# EAGLE design CH552_typeC_Power_Delivery (EAGLE 9.6.2)
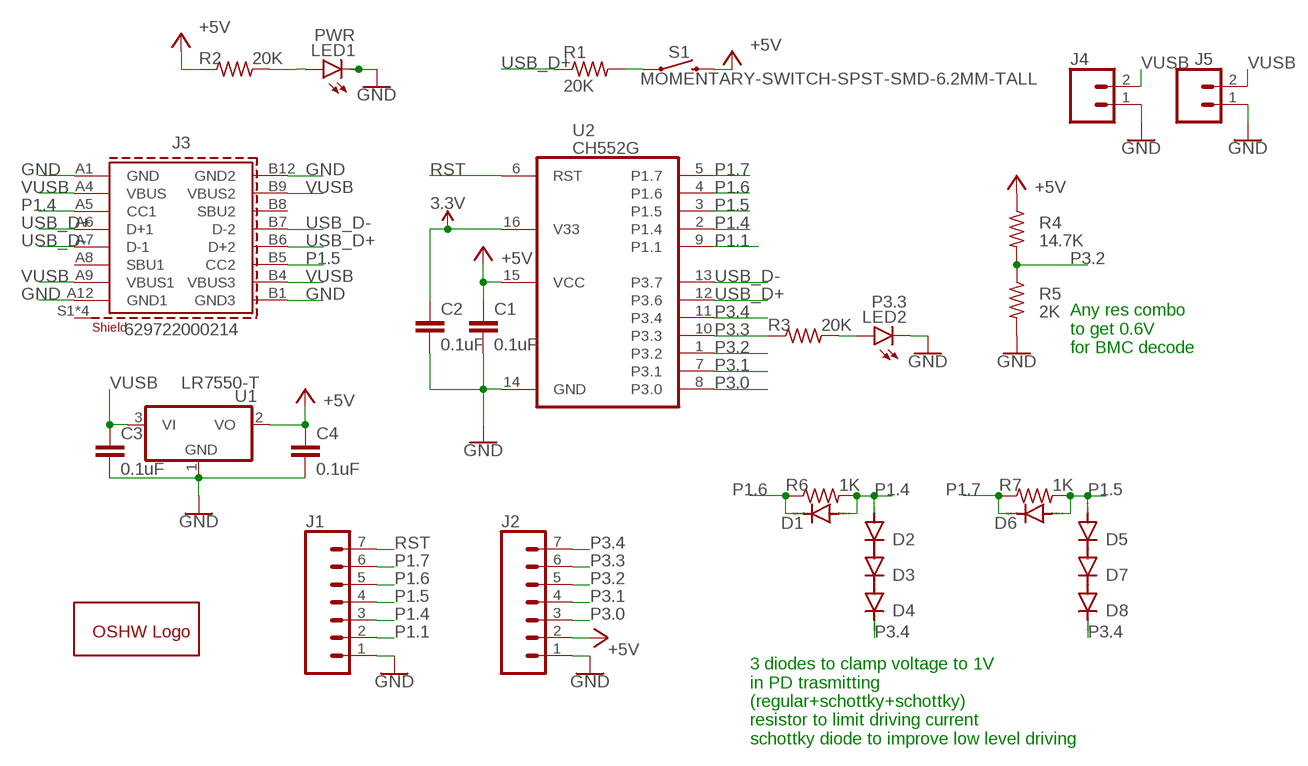
[diagram p0: schematic, sheet 1]

## Parts
C1  0.1uF  C-EUC0805K  [C0805K]
C2  0.1uF  C-EUC0805K  [C0805K]
C3  0.1uF  C-EUC0805K  [C0805K]
C4  0.1uF  C-EUC0805K  [C0805K]
D1  DIODE-SOD123  [SOD123]
D2  DIODE-SOD123  [SOD123]
D3  DIODE-SOD123  [SOD123]
D4  DIODE-SOD123  [SOD123]
D5  DIODE-SOD123  [SOD123]
D6  DIODE-SOD123  [SOD123]
D7  DIODE-SOD123  [SOD123]
D8  DIODE-SOD123  [SOD123]
GOLD_ORB_SM1  OSHWLOGOLOGO8MM  [OSHW_8MM]
J1  CONN_07NO_SILK  [1X07_NO_SILK]
J2  CONN_07NO_SILK  [1X07_NO_SILK]
J3  629722000214  [629722000214]
J4  CONN_021X02_NO_SILK  [1X02_NO_SILK]
J5  CONN_021X02_NO_SILK  [1X02_NO_SILK]
LED1  PWR  GHI-BASICCOMPONENTS_LED-(INCH)-0805  [GHI-BASICCOMPONENTS_0805-LED]
LED2  P3.3  GHI-BASICCOMPONENTS_LED-(INCH)-0805  [GHI-BASICCOMPONENTS_0805-LED]
R1  20K  R-US_R0805  [R0805]
R2  20K  R-US_R0805  [R0805]
R3  20K  R-US_R0805  [R0805]
R4  14.7K  R-US_R0805  [R0805]
R5  2K  R-US_R0805  [R0805]
R6  1K  R-US_R0805  [R0805]
R7  1K  R-US_R0805  [R0805]
S1  MOMENTARY-SWITCH-SPST-SMD-6.2MM-TALL  [TACTILE_SWITCH_SMD_6.2MM_TALL]
U1  MCP1703CB  [SOT23]
U2  CH552G  MY_IC_CH551G_CH552GSOP-16  [MY_IC_SO16]

## Nets
3.3V: C2.1 U2.16(V33)
+5V: C1.1 C4.1 J2.2 R2.1 R4.1 S1.B2 U1.2(VO) U2.15(VCC)
GND: C1.2 C2.2 C3.2 C4.2 J1.1 J2.1 J3.A1(GND) J3.A12(GND1) J3.B1(GND3) J3.B12(GND2) J4.1 J5.1 LED1.K LED2.K R5.2 U1.1(GND) U2.14(GND)
N$1: R1.2 S1.A2
N$2: LED2.A R3.2
N$3: LED1.A R2.2
N$4: D2.C D3.A
N$5: D3.C D4.A
N$6: D5.C D7.A
N$7: D7.C D8.A
P1.1: J1.2 U2.9(P1.1)
P1.4: D1.A D2.A J1.3 J3.A5(CC1) R6.2 U2.2(P1.4)
P1.5: D5.A D6.A J1.4 J3.B5(CC2) R7.2 U2.3(P1.5)
P1.6: D1.C J1.5 R6.1 U2.4(P1.6)
P1.7: D6.C J1.6 R7.1 U2.5(P1.7)
P3.0: J2.3 U2.8(P3.0)
P3.1: J2.4 U2.7(P3.1)
P3.2: J2.5 R4.2 R5.1 U2.1(P3.2)
P3.3: J2.6 R3.1 U2.10(P3.3)
P3.4: D4.C D8.C J2.7 U2.11(P3.4)
RST: J1.7 U2.6(RST)
USB_D+: J3.A6(D+1) J3.B6(D+2) R1.1 U2.12(P3.6)
USB_D-: J3.A7(D-1) J3.B7(D-2) U2.13(P3.7)
VUSB: C3.1 J3.A4(VBUS) J3.A9(VBUS1) J3.B4(VBUS3) J3.B9(VBUS2) J4.2 J5.2 U1.3(VI)
Unconnected: J3.A8(SBU1) J3.B8(SBU2) J3.S1(SHIELD) J3.S2(SHIELD) J3.S3(SHIELD) J3.S4(SHIELD)

## Notes on the sheet
- Any res combo
  to get 0.6V
  for BMC decode
- 3 diodes to clamp voltage to 1V
  in PD trasmitting
  (regular+schottky+schottky)
  resistor to limit driving current
  schottky diode to improve low level driving

## Library data of the parts
C1-C4 = rcl:C-EU: CAPACITOR, European symbol; LCSC: C16834; SPICEPREFIX: C
D1-D8 = diode:DIODE-: DIODE
GOLD_ORB_SM1 = oshw:OSHWLOGO: The OSHW logo for PCB layout
J1 J2 = SparkFun-Connectors:CONN_07: Multi connection point. Often used as Generic Header-pin footprint for 0.1 inch spaced/style header connections On any of the 0.1 inch spaced packages, you can populate with these: Break Away Headers - Straight <https://www.sparkfun.com/products/116> (PRT-00116) Break Away Male Headers - Right Angle <https://www.sparkfun.com/products/553> (PRT-00553) Female Headers <https://www.sparkfun.com/products/115> (PRT-00115) Break Away Headers - Machine Pin <https://www.sparkfun.com/products/117> (PRT-00117) Break Away Female Headers - Swiss Machine Pin <https://www.sparkfun.com/products/743> (PRT-00743) For SCREWTERMINALS and SPRING TERMINALS visit here: Screw Terimnals on SparkFun.com <https://www.sparkfun.com/search/results?term=Screw+Terminals> (5mm/3.5mm/2.54mm spacing) This device is also useful as a general connection point to wire up your design to another part of your project. Our various solder wires solder well into these plated through hole pads. Hook-Up Wire - Assortment (Stranded, 22 AWG) <https://www.sparkfun.com/products/11375> (PRT-11375) Hook-Up Wire - Assortment (Solid Core, 22 AWG) <https://www.sparkfun.com/products/11367> (PRT-11367) View the entire wire category on our website here <https://www.sparkfun.com/categories/141> Special notes: Molex polarized connector foot print use with SKU : PRT-08231 with associated crimp pins and housings. 1MM SMD Version SKU: PRT-10208 NOTES ON THE VARIANTS LOCK and LOCK_LONGPADS... This footprint was designed to help hold the alignment of a through-hole component (i.e. 6-pin header) while soldering it into place. You may notice that each hole has been shifted either up or down by 0.005 of an inch from it's more standard position (which is a perfectly straight line). This slight alteration caused the pins (the squares in the middle) to touch the edges of the holes. Because they are alternating, it causes a "brace" to hold the component in place. 0.005 has proven to be the perfect amount of "off-center" position when using our standard breakaway headers. Although looks a little odd when you look at the bare footprint, once you have a header in there, the alteration is very hard to notice. Also,if you push a header all the way into place, it is covered up entirely on the bottom side.
J3 = Wurth_Connectors_WR-USB:629722000214: WR-COM USB 2.0 Type C Receptacle Horizontal SMT Kind Properties Durability 10 000 Mating cycles Gender Receptacle Type Horizontal General Information Operating Temperature -40 up to +85 °C Electrical Properties Working Voltage 20 V (DC) Withstanding Voltage 100 V (AC) Contact Resistance 40 mΩ Material Properties Insulator Material LCP Insulator Flammability Rating UL94 V-0 Insulator Color Black Contact Material Brass Contact Plating Gold over Nickel Contact Type Stamped Shielding Material Steel Shielding Plating Nickel (Ni) <https://www.we-online.com/components/media/o689297v209%20family-wr-com-629722000214.jpg> Details see: www.we-online.com/en/components/products/WR-COM_USB_20_TYPE_C_RECEPTACLE_HORIZONTAL_SMT <www.we-online.com/catalog/WR-COM_USB_20_TYPE_C_RECEPTACLE_HORIZONTAL_SMT/?utm_source=eagle_model&utm_medium=description_link&utm_campaign=eisos_eagle> Updated by Ella Wu 2023-05-30 2023 (C) Würth Elektronik; APPLICATION: USB 2.0; DATASHEET-URL: https://www.we-online.com/redexpert/spec/629722000214?ae; GERDER: Receptacle; INTERFACE-TYPE: Type C; IR: 5A; LCSC: C165948 C2765186; MOUNT: SMT; PACKAGING: Tape and Reel; PART-NUMBER: 629722000214; PINS: 16; TYPE: Horizontal; WORKING-VOLTAGE: 20V(AC)
J4 J5 = SparkFun-Connectors:CONN_02: Multi connection point. Often used as Generic Header-pin footprint for 0.1 inch spaced/style header connections On any of the 0.1 inch spaced packages, you can populate with these: Break Away Headers - Straight <https://www.sparkfun.com/products/116> (PRT-00116) Break Away Male Headers - Right Angle <https://www.sparkfun.com/products/553> (PRT-00553) Female Headers <https://www.sparkfun.com/products/115> (PRT-00115) Break Away Headers - Machine Pin <https://www.sparkfun.com/products/117> (PRT-00117) Break Away Female Headers - Swiss Machine Pin <https://www.sparkfun.com/products/743> (PRT-00743) For SCREWTERMINALS and SPRING TERMINALS visit here: Screw Terimnals on SparkFun.com <https://www.sparkfun.com/search/results?term=Screw+Terminals> (5mm/3.5mm/2.54mm spacing) This device is also useful as a general connection point to wire up your design to another part of your project. Our various solder wires solder well into these plated through hole pads. Hook-Up Wire - Assortment (Stranded, 22 AWG) <https://www.sparkfun.com/products/11375> (PRT-11375) Hook-Up Wire - Assortment (Solid Core, 22 AWG) <https://www.sparkfun.com/products/11367> (PRT-11367) View the entire wire category on our website here <https://www.sparkfun.com/categories/141> Special notes: Molex polarized connector foot print use with: PRT-08233 with associated crimp pins and housings. 2.54_SCREWTERM for use with PRT-10571. 3.5mm Screw Terminal footprints for PRT-08084 5mm Screw Terminal footprints for use with PRT-08432
LED1 LED2 = BeagleBone_Black_Wireless:GHI-BASICCOMPONENTS_LED-(INCH)-
R1-R7 = rcl:R-US_: RESISTOR, American symbol; SPICEPREFIX: R
S1 = SparkFun-Switches:MOMENTARY-SWITCH-SPST: Momentary Switch (Pushbutton) - SPST Normally-open (NO) SPST momentary switches (buttons, pushbuttons). Variants PTH-12MM - 12mm square, through-hole Momentary Pushbutton Switch - 12mm Square <https://www.sparkfun.com/products/9190> (COM-09190) PTH-6.0MM, PTH-6.0MM-KIT - 6.0mm square, through-hole Mini Pushbutton Switch <https://www.sparkfun.com/products/97> (COM-00097) KIT package intended for soldering kit's - only one side of pads' copper is exposed. PTH-RIGHT-ANGLE-KIT - Right-angle, through-hole Right Angle Tactile Button <https://www.sparkfun.com/products/10791> - Used on SparkFun BigTime Watch Kit <https://www.sparkfun.com/products/11734> SMD-12MM - 12mm square, surface-mount Tactile Button - SMD (12mm) <https://www.sparkfun.com/products/12993> (COM-12993) Used on SparkFun PicoBoard <https://www.sparkfun.com/products/11888> SMD-4.5MM - 4.5mm Square Trackball Switch Used on SparkFun Blackberry Trackballer Breakout <https://www.sparkfun.com/products/13169> SMD-4.6MMX2.8MM - 4.60mm x 2.80mm, surface mount Used on SparkFun SAMD21 Mini Breakout <https://www.sparkfun.com/products/13664> SMD-5.2MM, SMD-5.2-REDUNDANT - 5.2mm square, surface-mount Mini Pushbutton Switch - SMD <https://www.sparkfun.com/products/8720> (COM-08720) Used on Arduino Pro Mini <https://www.sparkfun.com/products/11114> REDUNDANT package connects both switch circuits together SMD-6.0X3.5MM - 6.0 x 3.5mm, surface mount Momentary Reset Switch SMD <https://www.sparkfun.com/products/8229> (COM-08229) SMD-6.2MM-TALL - 6.2mm square, surface mount Tactile Button - SMD (6mm) <https://www.sparkfun.com/products/12992> Used on SparkFun Digital Sandbox <https://www.sparkfun.com/products/12651> SMD-RIGHT-ANGLE - Right-angle, surface mount Used on SparkFun Block for Intel® Edison - Arduino <https://www.sparkfun.com/products/13036>; PROD_ID: SWCH-11966; SF_SKU: COM-12992
U1 = linear:MCP1703: 250 mA, 16V, Low Quiescent Current LDO Regulator Source: http://ww1.microchip.com/downloads/en/DeviceDoc/22049b.pdf; ACTUAL_PART: LR7550-T
U2 = myOwnLib:MY_IC_CH551G_CH552G; LCSC: C111292

## Board
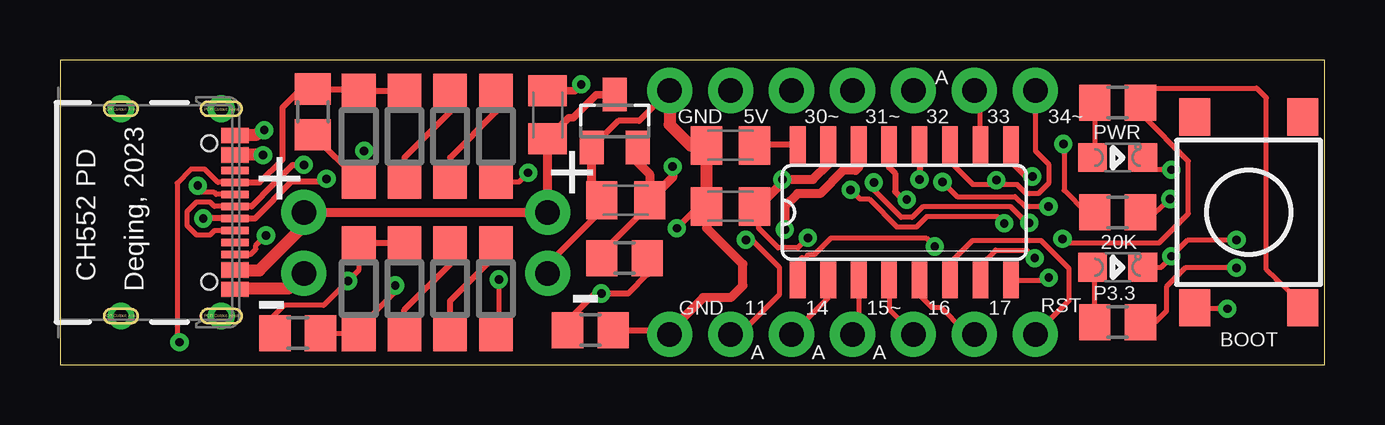
[diagram p1: board, top side]
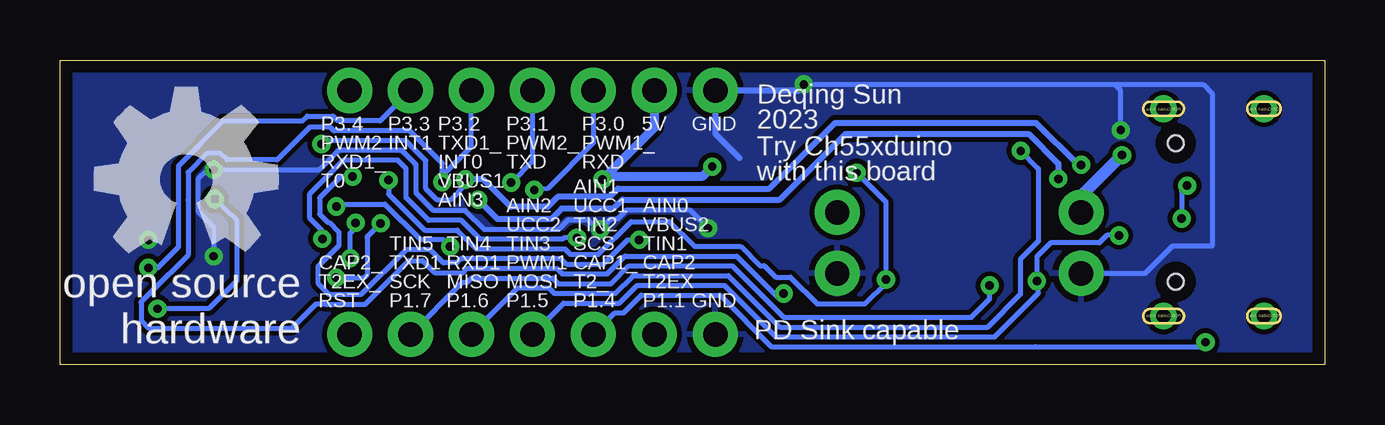
[diagram p2: board, bottom side, seen from below]

Size 52.7 x 12.7 mm. Coordinates in mm from the lower left corner, seen from the top.
Outline: 0,0 52.7,0 52.7,12.7 0,12.7 0,0
Copper layers (1*16): Top 0.035mm / dielectric 1.5mm / Bottom 0.035mm
Design rules "eagleRules10Mil *": minimum track width 8mil, minimum drill 0.3mm, track to track 8mil, track to pad 8mil, pad to pad 8mil, via to via 8mil, smd to smd 8mil, copper to edge 20mil, drill to drill 20mil, minimum pad ring 10mil, minimum via ring 8mil, stop-mask expansion 4mil, vias tented up to drill 14mil, thermal gap 10mil

### Footprints (pad centres in the part's own frame; a part is rotated, then mirrored left to right if it is on the bottom)
C0805K = smd 1.3 x 1.6: 1 -1,0; 2 1,0
SOD123 = smd 1.4 x 1.4: A 1.9,0; C -1.9,0
1X07_NO_SILK = drill 1.016 pad 1.88: 1 0,0; 2 2.54,0; 3 5.08,0; 4 7.62,0; 5 10.16,0; 6 12.7,0; 7 15.24,0
629722000214 = smd 0.3 x 1.15: A1 -3.35,4.745; A4 -2.55,4.745; A5 -1.25,4.745; A6 -0.25,4.745; A7 0.25,4.745; A8 1.25,4.745; A9 2.55,4.745; A12 3.35,4.745; B1 3.05,4.745; B4 2.25,4.745; B5 1.75,4.745; B6 0.75,4.745; B7 -0.75,4.745; B8 -1.75,4.745; B9 -2.25,4.745; B12 -3.05,4.745 | drill 0.6 pad 1: S1 -4.32,4.18; S2 4.32,4.18; S3 -4.32,0; S4 4.32,0 | hole 0.65: -2.89,3.68; 2.89,3.68
1X02_NO_SILK = drill 1.016 pad 1.88: 1 0,0; 2 2.54,0
GHI-BASICCOMPONENTS_0805-LED = smd 1.2 x 1.2: A 0,1.05; K 0,-1.05
R0805 = smd 1.3 x 1.5: 1 -0.95,0; 2 0.95,0
TACTILE_SWITCH_SMD_6.2MM_TALL = smd 1.55 x 1.3: A1 -3.975,-2.25; A2 3.975,-2.25; B1 -3.975,2.25; B2 3.975,2.25
SOT23 = smd 1 x 1.4: 1 -0.95,-1.1; 2 0.95,-1.1; 3 0,1.1
MY_IC_SO16 = smd 0.66 x 1.524: 1 -4.445,-2.819; 2 -3.175,-2.819; 3 -1.905,-2.819; 4 -0.635,-2.819; 5 0.635,-2.819; 6 1.905,-2.819; 7 3.175,-2.819; 8 4.445,-2.819; 9 4.445,2.819; 10 3.175,2.819; 11 1.905,2.819; 12 0.635,2.819; 13 -0.635,2.819; 14 -1.905,2.819; 15 -3.175,2.819; 16 -4.445,2.819

### Placement (x,y rotation side)
C1  27.94,6.6 180 top
C2  27.94,9.14 180 top
C3  20.32,10.41 90 top
C4  23.57,6.86 180 top
D1  12.45,9.53 90 top
D2  14.35,9.53 90 top
D3  16.26,9.53 90 top
D4  18.16,9.53 90 top
D5  14.35,3.17 90 top
D6  12.45,3.17 90 top
D7  16.26,3.17 90 top
D8  18.16,3.17 90 top
GOLD_ORB_SM1  47.47,7.72 0 bottom
J1  25.4,1.27 0 top
J2  25.4,11.43 0 top
J3  2.54,6.35 270 top
J4  10.16,3.81 90 top
J5  20.32,3.81 90 top
LED1  44.07,8.64 90 top
LED2  44.07,4.06 90 top
R1  44.07,6.35 0 top
R2  44.07,10.92 180 top
R3  44.07,1.78 180 top
R4  23.52,4.45 0 top
R5  22.1,1.45 0 top
R6  10.54,10.54 90 top
R7  9.91,1.32 180 top
S1  49.53,6.35 270 top
U1  23.11,10.16 0 top
U2  35.18,6.35 0 top

### Tracks (layer width: path | path; a pad name or v marks a point on that pad's centre or on a via)
3.3V
  Top 0.254: U2.16 28.96,9.17 C2.1
+5V  (via drill 0.35)
  Top 0.203: v31.16,5.29 30.75,4.88 29.92,4.88 29.11,5.69 29.11,6.45 | v41.77,5.25 41.94,5.08 45.8,5.08 47.02,6.3 47.02,8.48 45.11,10.39 45.11,10.83 R2.1 45.63,11.53 49.86,11.53 50.27,11.12 50.27,3.96 50.67,3.56 51.78,2.49 S1.B2
  Top 0.254: C1.1 29.11,6.6 | 30.1,7.59 v30.1,7.72 | C4.1 24.57,6.66 22.57,4.66 R4.1
  Top 0.305: 29.11,6.6 28.96,6.6 C1.1
  Top 0.381: v30.1,7.72 31.37,7.72 32,8.36 U2.15 | 29.11,6.6 30.1,7.59 | v25.53,8.26 25.53,7.81 C4.1 24.57,7.94 24.06,8.45 U1.2
  Top 0.508: 29.11,6.45 28.96,6.6
  Bottom 0.203: v31.16,5.29 31.7,5.29 31.76,5.23 35.2,5.23 35.98,6.02 37.34,6.02 38.28,6.96 38.28,8.18 38.63,8.53 40.9,8.53 42.29,7.13 42.29,6.1 41.77,5.58 v41.77,5.25
  Bottom 0.381: J2.2 27.94,9.88 v30.1,7.72 29.96,7.86 25.92,7.86 v25.53,8.26
GND  (via drill 0.35)
  Top 0.203: v46.3,8.13 45.63,8.13 LED1.K | LED2.K 45.88,4.06 46.3,4.49 v46.3,4.52 46.99,5.21 v49.02,5.21 | J3.A12 J3.B1 7.41,3.17
  Top 0.254: C1.2 26.62,6.6 v25.7,5.69 | J2.1 24.13,10.16 23.26,10.16 U1.1 | C4.2 22.57,6.44 20.32,4.19 J5.1 | R5.2 25.22,1.45 J1.1 | J3.A1 7.41,9.57 7.29,9.45 J3.B12 | 8.38,9.78 v8.51,9.78
  Top 0.305: C3.2 21.45,11.41 v21.72,11.68
  Top 0.381: v30.2,5.64 30.2,6.6 30.73,7.14 31.67,7.14 32.64,8.1 33.15,8.1 33.27,8.23 U2.14 | C1.2 26.94,5.7 28.45,4.19 28.45,3.3 27.94,2.79 26.8,2.79 25.4,1.4 J1.1 | C4.2 22.16,7.26 U1.1
  Top 0.508: C1.2 C2.2 26.26,9.14 25.4,10.01 J2.1 | 7.41,9.57 8.18,9.57 8.38,9.78 | J4.1 9.53,3.17 7.41,3.17 7.4,3.19 7.31,3.19
  Bottom 0.203: v46.3,4.52 46.3,5.74 46.97,6.4 46.97,7.72 46.56,8.13 v46.3,8.13 41.91,8.13 41.1,8.93 38.46,8.93 37.87,8.34 37.87,7.17 37.12,6.43 35.81,6.43 35.03,5.64 31.93,5.64 31.52,6.04 30.71,6.04 30.3,5.64 v30.2,5.64 29.76,6.08 29.47,6.08 29.1,6.45 26.47,6.45 v25.7,5.69 | v21.72,11.68 8.76,11.68 | 8.76,11.68 5.08,11.68 4.7,11.3 4.7,4.95 6.35,4.95 7.49,3.81 J4.1 | v8.51,9.78 8.51,11.43 8.76,11.68
  Bottom 0.254: 24.38,8.61 25.4,9.63 J2.1 21.97,11.43
  Bottom 0.305: 21.97,11.43 v21.72,11.68
  pour Bottom: 0,0 52.7,0 52.7,12.7 0,12.7
N$1  (via drill 0.35)
  Top 0.203: R1.2 45.64,6.35 v46.25,6.91 | v48.64,2.34 47.32,2.34 S1.A2
  Bottom 0.203: v46.25,6.91 45.34,6.04 45.34,3.5 46.51,2.34 v48.64,2.34
N$2
  Top 0.203: R3.2 43.12,3.96 LED2.A
N$3
  Top 0.203: R2.2 43.12,8.74 LED1.A
N$4
  Top 0.254: D3.A 16.26,10.54 14.35,8.64 D2.C
N$5
  Top 0.254: D4.A 18.16,10.54 16.26,8.64 D3.C
N$6
  Top 0.254: D5.C 14.35,2.29 16.26,4.19 D7.A
N$7
  Top 0.254: D7.C 16.26,2.67 18.16,4.57 D8.A
P1.1  (via drill 0.35)
  Top 0.203: v40.51,7.84 40.24,7.84 39.6,8.48 39.6,9.14 U2.9 | v28.57,5.21 28.83,5.21 29.97,4.06 29.97,2.92 28.32,1.27 J1.2
  Bottom 0.203: v40.51,7.84 41,7.84 41.88,6.96 41.88,6.27 41.54,5.93 41.49,5.93 41.09,5.53 41.09,4.96 41.96,4.09 41.96,3.4 41.48,2.92 40.16,2.92 38.29,4.8 37.28,4.8 36.73,4.25 36.17,4.25 35.99,4.42 31.83,4.42 31.61,4.2 30.07,4.2 29.06,5.21 v28.57,5.21
P1.4  (via drill 0.35)
  Top 0.203: U2.2 32,2.79 J1.3 | J3.A5 6.57,7.6 6.02,8.15 5.46,8.15 4.88,7.57 4.88,1.04 v4.98,0.94
  Top 0.254: D2.A D1.A 12.38,11.49 R6.2 10.03,11.49 9.27,10.73 9.27,8.55 8.32,7.6 J3.A5
  Bottom 0.203: J1.3 29.58,2.17 29.22,2.17 28.49,2.9 25.2,2.9 23.06,0.76 12.06,0.76 4.98,0.76 v4.98,0.94
P1.5  (via drill 0.35)
  Top 0.203: U2.3 33.27,1.52 J1.4 | D6.A 12.45,3.94 v12,3.49 10.99,2.48 9.34,2.48 8.76,1.91 | J3.B5 7.94,4.6 8.16,4.82 8.16,4.97 v8.58,5.39
  Top 0.254: D5.A D6.A | R7.2 8.76,1.51 8.76,1.91
  Bottom 0.203: J1.4 31.72,2.57 29.39,2.57 28.66,3.31 25.02,3.31 22.89,1.17 13.76,1.17 11.94,2.99 11.94,3.49 v12,3.49 12,4.51 11.43,5.08 9.4,5.08 9.09,5.39 v8.58,5.39
P1.6  (via drill 0.35)
  Top 0.203: U2.4 34.54,2.29 J1.5 | D1.C 12.68,7.85 v12.68,8.91
  Top 0.254: R6.1 12.45,7.69 D1.C
  Bottom 0.203: J1.5 33.63,3.2 32.34,3.2 32.12,2.98 29.56,2.98 28.83,3.71 24.85,3.71 22.72,1.57 14.05,1.57 12.68,2.94 12.68,4.4 11.94,5.15 11.94,8.18 v12.68,8.91
P1.7  (via drill 0.35)
  Top 0.203: U2.5 35.81,2.9 36.32,2.39 36.7,2.39 37.64,1.45 37.92,1.45 J1.6 | R7.1 12.4,1.32 D6.C 12.45,1.52 13.97,3.05 v13.97,3.3
  Bottom 0.203: J1.6 35.94,3.44 35.74,3.44 35.57,3.61 32.17,3.61 31.95,3.39 29.73,3.39 29,4.12 24.68,4.12 22.55,1.98 14.73,1.98 13.97,2.74 v13.97,3.3
P3.0  (via drill 0.35)
  Top 0.203: v32.94,7.29 33.33,6.91 33.72,6.91 34.88,5.74 35.68,5.74 36.11,6.17 39.06,6.17 v39.34,5.89 | U2.8 41.1,3.53 v41.2,3.63
  Bottom 0.203: J2.3 30.48,9.25 32.38,7.34 v32.94,7.29 | v41.2,3.63 40.03,3.63 39.9,3.76 39.9,5.33 v39.34,5.89
P3.1  (via drill 0.35)
  Top 0.203: v33.91,7.59 33.91,7.29 35.05,6.15 35.51,6.15 35.94,6.58 39.62,6.58 40.29,5.92 v40.39,5.92 | U2.7 38.35,4.14 38.99,4.78 40.28,4.78 v40.62,4.45
  Bottom 0.203: J2.4 33.02,8.48 v33.91,7.59 | v40.62,4.45 40.62,5.49 40.39,5.71 v40.39,5.92
P3.2  (via drill 0.35)
  Top 0.203: U2.1 30.73,4.29 30.91,4.47 31.07,4.47 31.2,4.61 31.44,4.61 32.13,5.29 36.09,5.29 v36.45,4.93 | v36.77,7.62 37.38,7.01 39.8,7.01 40.21,6.6 40.86,6.6 40.87,6.59 v41.19,6.59
  Top 0.254: R4.2 24.47,3.77 23.67,2.97 v22.55,2.97 22.27,2.97 21.15,1.84 R5.1
  Bottom 0.203: J2.5 35.56,9.09 36.77,7.88 v36.77,7.62 36.77,8.39 38.13,9.75 41.29,9.75 41.45,9.91 42.29,9.91 43.66,8.53 45.74,8.53 46.02,8.81 46.59,8.81 47.37,8.03 47.37,6.86 47.37,4.57 48.92,3.02 49.32,2.62 49.32,1.83 49.02,1.52 43.05,1.52 42.04,2.54 41.67,2.54 41.65,2.52 40,2.52 38.17,4.34 37.59,4.34 37.09,3.84 35.91,3.84 35.74,4.01 32,4.01 31.78,3.79 29.9,3.79 29.17,4.52 24.52,4.52 22.79,2.79 22.55,2.79 v22.55,2.97 | v36.45,4.93 36.73,5.21 37.68,5.21 39.17,6.7 41.19,6.7 v41.19,6.59
P3.3  (via drill 0.35)
  Top 0.203: U2.10 38.35,11.18 J2.6 | v49.02,4.04 46.89,4.04 46.1,3.25 46.1,2.23 45.64,1.78 R3.1
  Bottom 0.203: J2.6 39.37,10.16 40.89,10.16 40.92,10.19 41.16,10.19 41.33,10.36 42.41,10.36 42.61,10.16 45.9,10.16 47.78,8.28 47.78,4.9 48.64,4.04 v49.02,4.04
P3.4  (via drill 0.35)
  Top 0.203: U2.11 37.08,8.46 38.02,7.52 38.73,7.52 | 38.73,7.52 39.87,7.52 40.25,7.13 40.77,7.13 41.2,7.56 41.2,8.36 40.64,8.91 J2.7 | 38.73,7.52 38.91,7.69 v39.01,7.69 | v18.29,3.56 18.29,1.4 D8.C | D4.C 19.13,7.62 v19.51,8
  Bottom 0.203: v39.01,7.69 39.01,7.12 37.51,5.61 36.15,5.61 35.36,4.83 31.66,4.83 31.44,4.61 30.27,4.61 28.9,5.97 27.3,5.97 26.27,4.93 24.35,4.93 23.55,4.13 23.37,4.13 22.89,3.65 22.27,3.65 21.16,2.54 19.18,2.54 18.29,3.43 v18.29,3.56 18.29,6.78 v19.51,8
RST
  Top 0.203: U2.6 37.08,4.24 38.02,5.18 40.87,5.18 42.03,4.02 42.03,2.66 J1.7
USB_D+  (via drill 0.35)
  Top 0.203: v41.81,9.2 41.83,9.17 41.83,7.26 42.75,6.35 R1.1 | J3.A6 6.43,6.6 6.25,6.78 5.69,6.78 5.29,6.38 5.29,5.81 5.69,5.41 6.25,5.41 6.44,5.6 J3.B6
  Top 0.254: U2.12 v35.81,7.72 | v10.16,8.33 9.7,8.33 8.43,7.07 8.43,7.05 7.99,6.6 J3.A6
  Bottom 0.203: v35.81,7.72 35.81,7.49 36.45,6.86 36.98,6.86 37.47,7.34 37.47,8.51 38.3,9.34 41.66,9.34 v41.81,9.2
  Bottom 0.254: v35.81,7.72 35.07,7.72 33.92,6.58 32.38,6.58 31.97,7 29.81,7 29.46,7.34 23.15,7.34 20.41,10.08 12.04,10.08 10.29,8.33 v10.16,8.33
USB_D-  (via drill 0.35)
  Top 0.203: J3.B7 6.51,7.1 6.42,7.18 5.74,7.18 v5.74,7.47
  Top 0.254: U2.13 34.54,8.23 34.8,7.98 34.8,7.21 35.13,6.88 v35.28,6.88 | v11.11,7.75 10.98,7.62 9.63,7.62 8.89,6.88 8.89,6.86 8.13,6.1 J3.A7 v5.97,6.1
  Bottom 0.203: v5.74,7.47 5.97,7.24 v5.97,6.1
  Bottom 0.254: v35.28,6.88 34.47,6.07 32.25,6.07 31.81,6.51 29.65,6.51 29.27,6.88 22.71,6.88 19.97,9.62 12.35,9.62 11.11,8.38 v11.11,7.75
VUSB  (via drill 0.35)
  Top 0.203: J3.A4 J3.B9 | 7.42,3.94 7.42,3.96 J3.B4 J3.A9
  Top 0.254: J3.B9 7.45,8.76 | 8.51,8.76 8.48,8.74 v8.46,8.74
  Top 0.305: C3.1 21.19,10.29 21.38,10.29 22.35,11.26 U1.3
  Top 0.381: J4.2 J5.2 C3.1
  Top 0.508: 7.45,8.76 8.51,8.76 | J4.2 10.16,5.79 8.31,3.94 7.42,3.94
  Bottom 0.508: v8.46,8.74 10.16,7.03 J4.2

### Text on the board
tNames: A | GND | 5V | 30~ | 31~ | 32 | 33 | 34~ | PWR | + | + | 20K | CH552 PD | Deqing, 2023 | P3.3 | - | GND | 11 | 14 | 15~ | 16 | 17 | RST | - | BOOT | A | A | A
bNames: Deqing Sun / 2023 | GND | 5V | P3.0 / PWM1_ / RXD | P3.1 / PWM2_ / TXD | P3.2 / TXD1_ / INT0 / VBUS1 / AIN3 | P3.3 / INT1 | P3.4 / PWM2 / RXD1_ / T0 | Try Ch55xduino / with this board | GND | AIN0 / VBUS2 / TIN1 / CAP2 / T2EX / P1.1 | AIN1 / UCC1 / TIN2 / SCS / CAP1_ / T2_ / P1.4 | AIN2 / UCC2 / TIN3 / PWM1 / MOSI / P1.5 | TIN4 / RXD1 / MISO / P1.6 | TIN5 / TXD1 / SCK / P1.7 | CAP2_ / T2EX_ / RST | PD Sink capable